# Altium schematic sheet Communication.SchDoc: USB <-> RS232
size A4; Date: 28.08.2010; ApprovedBy: V.Gyurov; CheckedBy: V.Gyurov; Author: V.Gyurov; CompanyName: V.Gyurov; DrawnBy: V.Gyurov; Engineer: V.Gyurov; DocumentNumber: 6; Revision: 00; SheetNumber: 6; SheetTotal: 7; VersionControl_RevNumber: V1.00 R.00; CurrentDate: 28.08.2010; DocumentName: USB <-> RS232; ModifiedDate: 28.08.2010
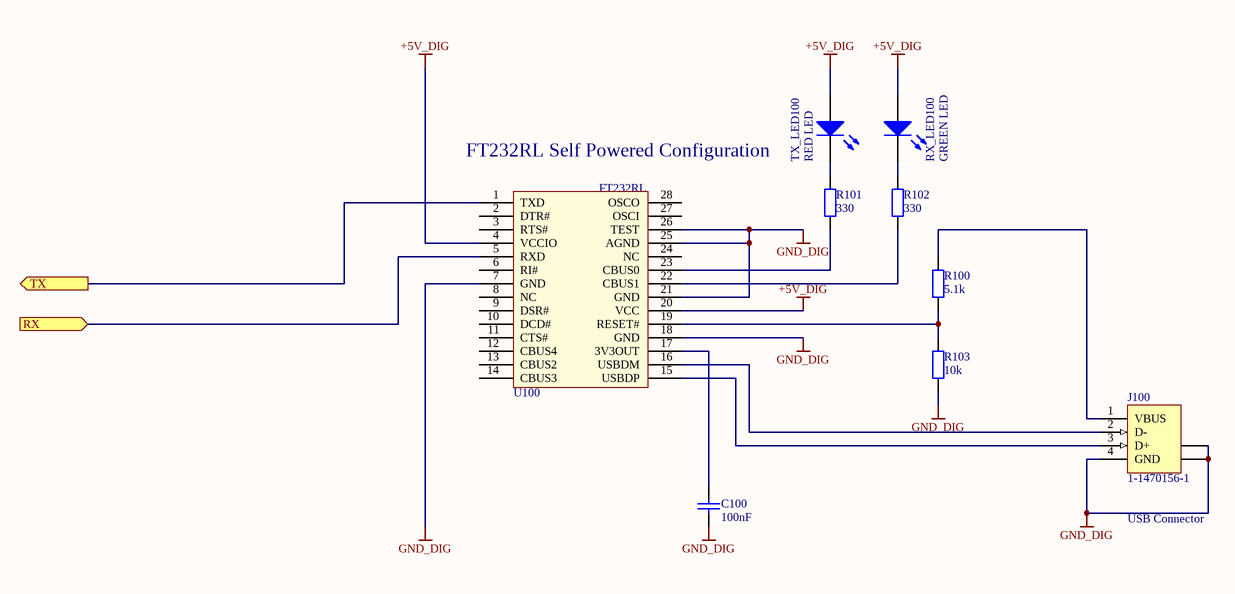
[diagram p0: Communication.SchDoc]

## Parts
C100  value 100nF  [3216[1206]]  (hidden comment: Cap)
J100  1-1470156-1  [USB2.5-2H4D]
R100  value 5.1k  [3216[1206]]  (hidden comment: Resistor)
R101  value 330  [3216[1206]]  (hidden comment: Resistor)
R102  value 330  [3216[1206]]  (hidden comment: Resistor)
R103  value 10k  [3216[1206]]  (hidden comment: Resistor)
RX_LED100  GREEN LED  [LED_1206]
TX_LED100  RED LED  [LED_1206]
U100  FT232RL  [SSOP28]

## Ports
RX (in), TX (out)

## Nets
+5V_DIG: RX_LED100.A TX_LED100.A U100.4(VCCIO) U100.20(VCC)
GND_DIG: C100.1 J100.4(GND) J100.5(SHLD) J100.6(SHLD) R103.1 U100.7(GND) U100.18(GND) U100.21(GND) U100.25(AGND) U100.26(TEST)
RX: U100.5(RXD) ; port RX
TX: U100.1(TXD) ; port TX
NetC100_2: C100.2 U100.17(3V3OUT)
NetJ100_1: J100.1(VBUS) R100.2
NetJ100_2: J100.2(D-) U100.16(USBDM)
NetJ100_3: J100.3(D+) U100.15(USBDP)
NetR100_1: R100.1 R103.2 U100.19(RESET#)
NetR101_1: R101.1 U100.23(CBUS0)
NetR101_2: R101.2 TX_LED100.K
NetR102_1: R102.1 U100.22(CBUS1)
NetR102_2: R102.2 RX_LED100.K

Not connected (* = marked no-connect by the designer): U100 2(DTR#) 3(RTS#) 6(RI#) 8(NC) 9(DSR#) 10(DCD#) 11(CTS#) 12(CBUS4) 13(CBUS2) 14(CBUS3) 24(NC) 27(OSCI) 28(OSCO)

## Notes on the sheet
- FT232RL Self Powered Configuration
- USB Connector
- Title
- Size:
- Date:
- A4
- Number:
- Time:
- Revision:
- Sheet
- of
- File:

## Library data of the parts
J100 = 1-1470156-1: USB 1.1, Right Angle, Thru-Hole, B Type, Receptacle, 4 Position, White; ContactMaterial: Phosphor Bronze; ContactPlating: Gold over Nickel; TerminationLength: 3.00mm [0.118in.]; PCB_Layout: Complies with manufacturer's recommendation.; DrillSize: Corresponds to nominal value.; PanelGround: Without; Published: 15-Jul-2004; DatasheetDocument: 02-Jun-2001; PackageDocument: 02-Jun-2001; PackageReference: 1-1470156; Publisher: Altium Limited; HousingMaterial: Glass-Filled Thermoplastic; ComponentLink1Description: Manufacturer Link; ComponentLink1URL: http://www.tycoelectronics.com/; ComponentLink2Description: Packaging Specification; ComponentLink2URL: http://ecommas.tycoelectronics.com/commerce/DocumentDelivery/DDEController?Action=showdoc&DocId=Customer+Drawing%7F1470156%7FO%7Ftif%7FEnglish%7FC_1470156_O.tif
R100-R103 = RES1
RX_LED100 TX_LED100 = LED: Value: TBD
U100 = FT232RL: Value: FT232RL